# EAGLE schematic mso5000_analyzer (EAGLE 9.6.2)
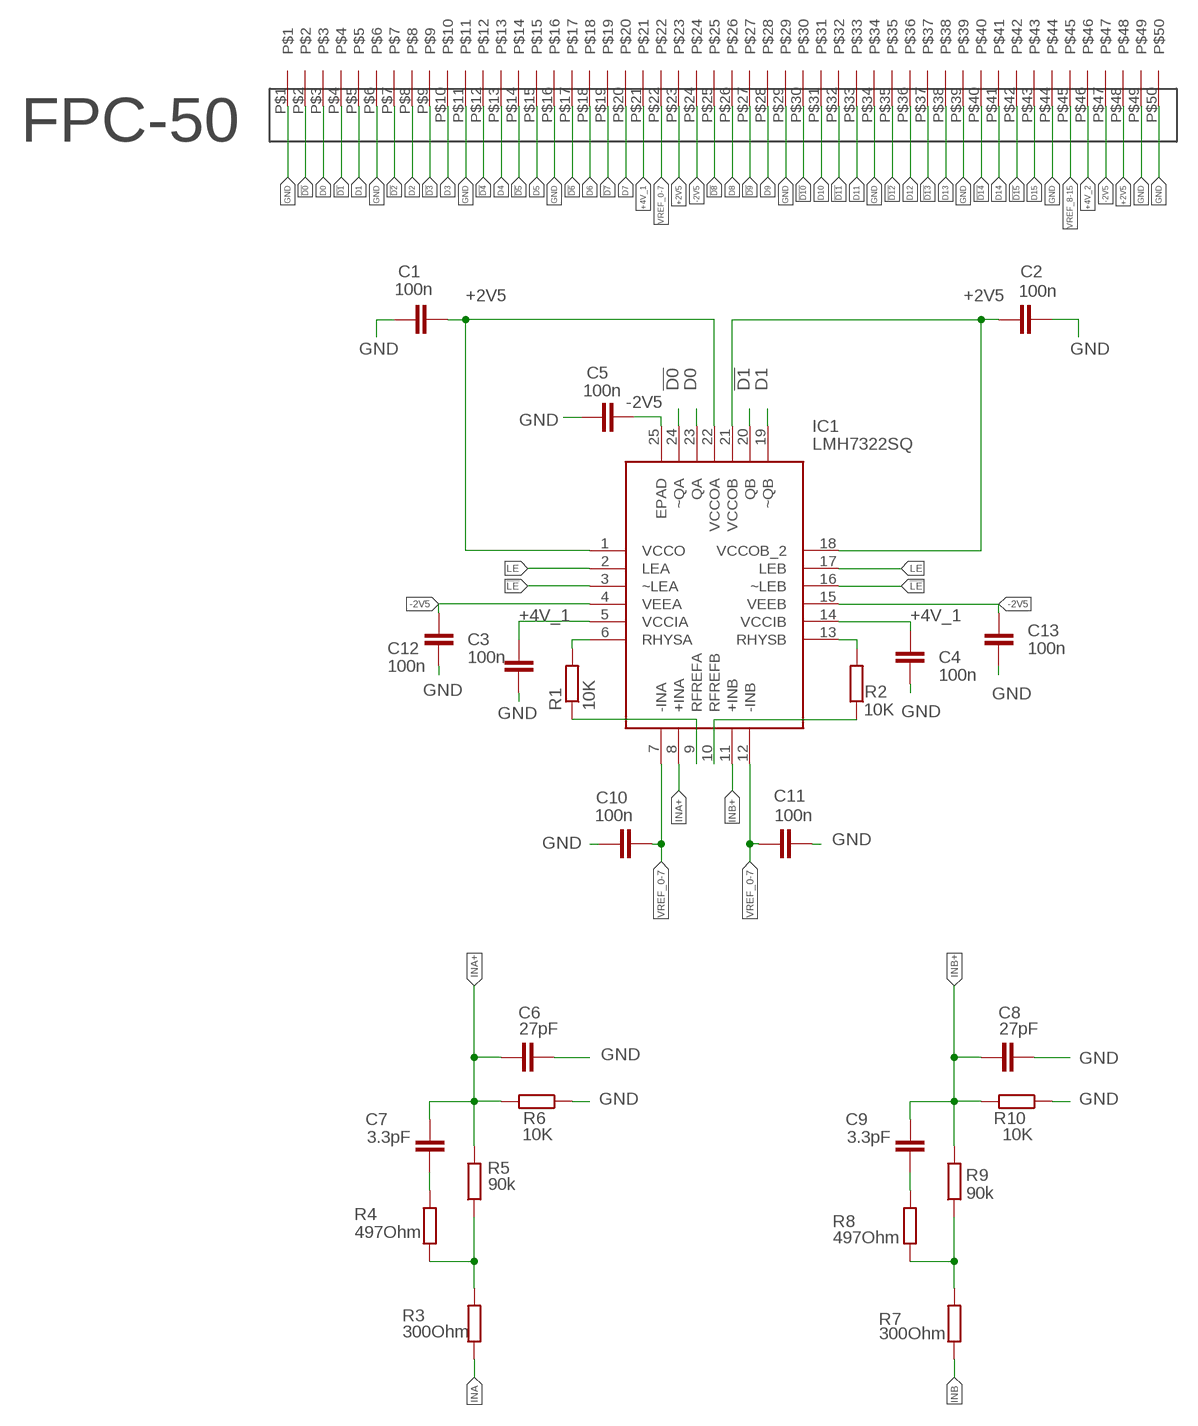
[diagram p0: schematic, sheet 1]

## Parts
C1  100n  C-EUC0805  [C0805]
C2  100n  C-EUC0805  [C0805]
C3  100n  C-EUC0805  [C0805]
C4  100n  C-EUC0805  [C0805]
C5  100n  C-EUC0805  [C0805]
C6  27pF  C-EUC0805  [C0805]
C7  3.3pF  C-EUC0805  [C0805]
C8  27pF  C-EUC0805  [C0805]
C9  3.3pF  C-EUC0805  [C0805]
C10  100n  C-EUC0805  [C0805]
C11  100n  C-EUC0805  [C0805]
C12  100n  C-EUC0805  [C0805]
C13  100n  C-EUC0805  [C0805]
FPC-50  ZIFF-050  [ZIFF-050]
IC1  LMH7322SQ  [QFN50P400X400X80-25N]
R1  10K  R-EU_R0805  [R0805]
R2  10K  R-EU_R0805  [R0805]
R3  300Ohm  R-EU_R0805  [R0805]
R4  497Ohm  R-EU_R0805  [R0805]
R5  90k  R-EU_R0805  [R0805]
R6  10K  R-EU_R0805  [R0805]
R7  300Ohm  R-EU_R0805  [R0805]
R8  497Ohm  R-EU_R0805  [R0805]
R9  90k  R-EU_R0805  [R0805]
R10  10K  R-EU_R0805  [R0805]

## Nets
!D0: FPC-50.P$2 IC1.24(~QA)
!D1: FPC-50.P$4 IC1.20(QB)
!D2: FPC-50.P$7
!D3: FPC-50.P$9
!D4: FPC-50.P$12
!D5: FPC-50.P$14
!D6: FPC-50.P$17
!D7: FPC-50.P$19
!D8: FPC-50.P$25
!D9: FPC-50.P$27
!D10: FPC-50.P$30
!D11: FPC-50.P$32
!D12: FPC-50.P$35
!D13: FPC-50.P$37
!D14: FPC-50.P$40
!D15: FPC-50.P$42
!LE: IC1.3(~LEA) IC1.16(~LEB)
+2V5: C1.1 C2.2 FPC-50.P$23 FPC-50.P$48 IC1.1(VCCO) IC1.18(VCCOB_2) IC1.21(VCCOB) IC1.22(VCCOA)
+4V_1: C3.1 C4.1 FPC-50.P$21 IC1.5(VCCIA) IC1.14(VCCIB)
+4V_2: FPC-50.P$46
-2V5: C5.1 C12.1 C13.1 FPC-50.P$24 FPC-50.P$47 IC1.4(VEEA) IC1.15(VEEB) IC1.25(EPAD)
D0: FPC-50.P$3 IC1.23(QA)
D1: FPC-50.P$5 IC1.19(~QB)
D2: FPC-50.P$8
D3: FPC-50.P$10
D4: FPC-50.P$13
D5: FPC-50.P$15
D6: FPC-50.P$18
D7: FPC-50.P$20
D8: FPC-50.P$26
D9: FPC-50.P$28
D10: FPC-50.P$31
D11: FPC-50.P$33
D12: FPC-50.P$36
D13: FPC-50.P$38
D14: FPC-50.P$41
D15: FPC-50.P$43
GND: C1.2 C2.1 C3.2 C4.2 C5.2 C6.2 C8.2 C10.1 C11.2 C12.2 C13.2 FPC-50.P$1 FPC-50.P$6 FPC-50.P$11 FPC-50.P$16 FPC-50.P$29 FPC-50.P$34 FPC-50.P$39 FPC-50.P$44 FPC-50.P$49 FPC-50.P$50 R6.1 R10.1
INA: R3.1
INA+: C6.1 C7.2 IC1.8(+INA) R5.2 R6.2
INB: R7.1
INB+: C8.1 C9.2 IC1.11(+INB) R9.2 R10.2
LE: IC1.2(LEA) IC1.17(LEB)
N$1: IC1.10(RFREFB) R2.1
N$2: R3.2 R4.1 R5.1
N$3: IC1.6(RHYSA) R1.2
N$4: IC1.9(RFREFA) R1.1
N$5: IC1.13(RHYSB) R2.2
N$6: C7.1 R4.2
N$8: R7.2 R8.1 R9.1
N$9: C9.1 R8.2
VREF_0-7: C10.2 C11.1 FPC-50.P$22 IC1.7(-INA) IC1.12(-INB)
VREF_8-15: FPC-50.P$45

## Library data of the parts
C1-C13 = rcl:C-EU: CAPACITOR, European symbol; SPICEPREFIX: C
FPC-50 = pinhead:ZIFF-050
IC1 = SamacSys_Parts:LMH7322SQ: High Speed Comparator Source: Datasheet; ARROW_PART_NUMBER: LMH7322SQ; DESCRIPTION: High Speed Comparator; HEIGHT: mm; MANUFACTURER_NAME: Texas Instruments; MANUFACTURER_PART_NUMBER: LMH7322SQ
R1-R10 = rcl:R-EU_: RESISTOR, European symbol; SPICEPREFIX: R